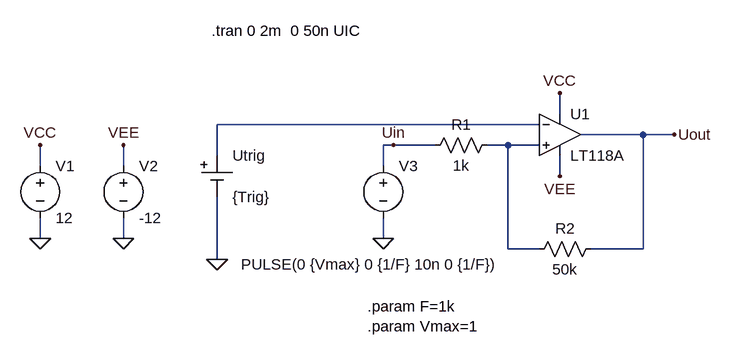
[diagram p0: schematic Mess_d.asc]
Mess_d.asc, the LTspice schematic file:
Version 4
SHEET 1 888 680
WIRE 304 -48 304 -80
WIRE 272 -32 -224 -32
WIRE 432 -16 336 -16
WIRE 480 -16 432 -16
WIRE 48 0 32 0
WIRE 112 0 48 0
WIRE 224 0 192 0
WIRE 272 0 224 0
WIRE -224 16 -224 -32
WIRE -496 32 -496 0
WIRE -368 32 -368 0
WIRE 32 32 32 0
WIRE 304 48 304 16
WIRE -496 144 -496 112
WIRE -368 144 -368 112
WIRE 32 144 32 112
WIRE 224 160 224 0
WIRE 272 160 224 160
WIRE 432 160 432 -16
WIRE 432 160 352 160
WIRE -224 176 -224 80
FLAG -224 176 0
FLAG 480 -16 Uout
FLAG -496 144 0
FLAG -368 144 0
FLAG -496 0 VCC
FLAG -368 0 VEE
FLAG 304 -80 VCC
FLAG 304 48 VEE
FLAG 32 144 0
FLAG 48 0 Uin
SYMBOL voltage -496 16 R0
SYMATTR InstName V1
SYMATTR Value 12
SYMBOL voltage -368 16 R0
SYMATTR InstName V2
SYMATTR Value -12
SYMBOL Misc/cell -224 16 R0
SYMATTR InstName Utrig
SYMATTR Value {Trig}
SYMBOL res 208 -16 R90
WINDOW 0 0 56 VBottom 2
WINDOW 3 32 56 VTop 2
SYMATTR InstName R1
SYMATTR Value 1k
SYMBOL res 368 144 R90
WINDOW 0 0 56 VBottom 2
WINDOW 3 32 56 VTop 2
SYMATTR InstName R2
SYMATTR Value 50k
SYMBOL OpAmps/LT118A 304 -16 R0
SYMATTR InstName U1
SYMBOL voltage 32 16 R0
WINDOW 3 -219 168 Left 2
SYMATTR Value PULSE(0 {Vmax} 0 {1/F} 10n 0 {1/F})
SYMATTR InstName V3
TEXT -232 -176 Left 2 !.tran 0 2m  0 50n UIC
TEXT 8 248 Left 2 !.param F=1k\n.param Vmax=1

The netlist it stands for:
* Mess_d.asc
V1 VCC 0 12
V2 VEE 0 -12
V§Utrig N001 0 {Trig}
R1 N002 Uin 1k
R2 Uout N002 50k
* U1: LT118A (symbol OpAmps/LT118A not available, pins judged from their places): In+=N002 In-=N001 V+=VCC V-=VEE OUT=Uout
V3 Uin 0 PULSE(0 {Vmax} 0 {1/F} 10n 0 {1/F})
.tran 0 2m  0 50n UIC
.param F=1k
.param Vmax=1
.backanno
.end